# Altium project TDA2030 2.1.PrjPcb
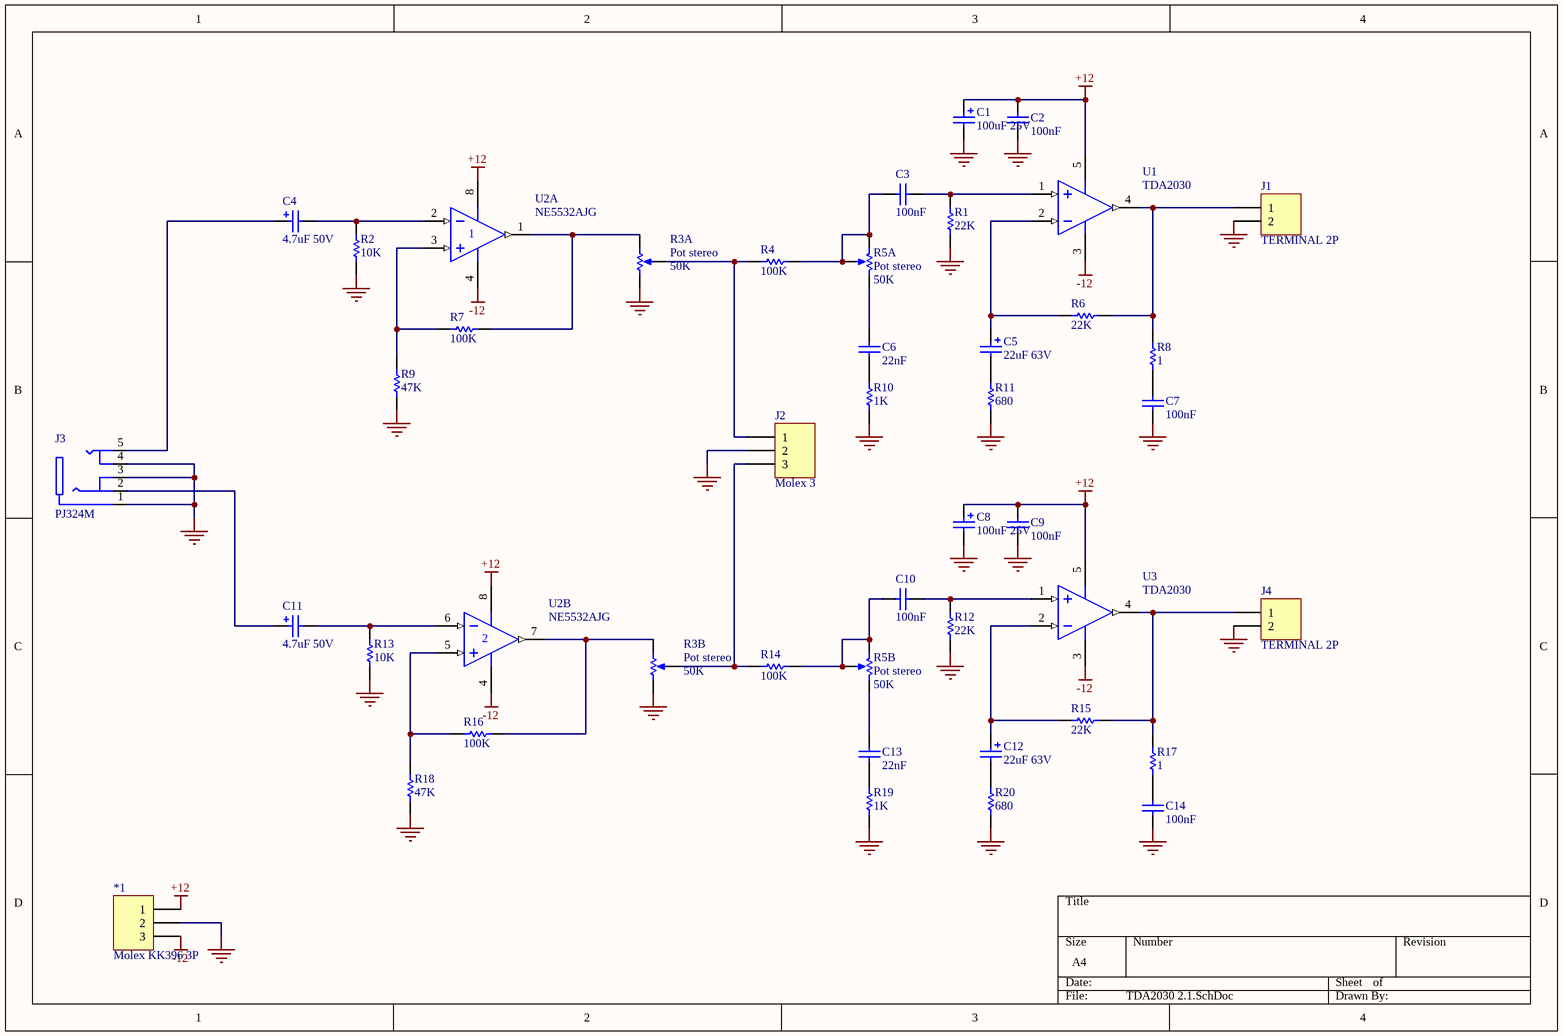
[diagram p0: TDA2030 2.1.SchDoc]
1 sheet, 42 parts. Net scope: global (net labels, ports and power ports of the same name join across sheets).
Board file: PCB.PcbDoc

## Sheet TDA2030 2.1.SchDoc
size A4

### Parts
*1  Molex KK396 3P  [Molex kk396 3P]
C1  100uF 25V  [100uF 25V]
C2  100nF  [104]
C3  100nF  [104]
C4  4.7uF 50V  [4.7uF 50V]
C5  22uF 63V  [22uF 63V]
C6  22nF  [104]
C7  100nF  [104]
C8  100uF 25V  [100uF 25V]
C9  100nF  [104]
C10  100nF  [104]
C11  4.7uF 50V  [4.7uF 50V]
C12  22uF 63V  [22uF 63V]
C13  22nF  [104]
C14  100nF  [104]
J1  TERMINAL 2P  [TERMINAL 2P]
J2  Molex 3  [Molex kk100 3P]
J3  PJ324M  [WENZHOU_PJ324M]
J4  TERMINAL 2P  [TERMINAL 2P]
R1  22K  [AXIAL-0.4]
R2  10K  [AXIAL-0.4]
R3  Pot stereo  value 50K  [Pote doble]  (parts A,B of 2)
R4  100K  [AXIAL-0.4]
R5  Pot stereo  value 50K  [Pote doble]  (parts A,B of 2)
R6  22K  [AXIAL-0.4]
R7  100K  [AXIAL-0.4]
R8  1  [AXIAL-0.4]
R9  47K  [AXIAL-0.4]
R10  1K  [AXIAL-0.4]
R11  680  [AXIAL-0.4]
R12  22K  [AXIAL-0.4]
R13  10K  [AXIAL-0.4]
R14  100K  [AXIAL-0.4]
R15  22K  [AXIAL-0.4]
R16  100K  [AXIAL-0.4]
R17  1  [AXIAL-0.4]
R18  47K  [AXIAL-0.4]
R19  1K  [AXIAL-0.4 MIA]
R20  680  [AXIAL-0.4]
U1  TDA2030  [TDA2030]
U2  NE5532AJG  [DIP-8]  (parts A,B of 2)
U3  TDA2030  [TDA2030]

### Nets
+12: *1.1 C1.1 C2.2 C8.1 C9.1 U1.5(V+) U2.8(V+) U3.5(V+)
-12: *1.3 U1.3(V-) U2.4(V-) U3.3(V-)
GND: *1.2 C1.2 C2.1 C7.2 C8.2 C9.2 C14.2 J1.2 J2.2 J3.1(SLEEVE) J3.3(RING_2) J3.4(TIP_1) J4.2 R1.1 R2.2 R3.1(TOP) R3.4(TOP) R9.2 R10.2 R11.1 R12.1 R13.2 R18.2 R19.2 R20.1
NetC3_1: C3.1 R1.2 U1.1(IN+)
NetC3_2: C3.2 R4.1 R5.2(TAP) R5.3(BOT)
NetC4_1: C4.1 J3.5(TIP_2)
NetC4_2: C4.2 R2.1 U2.2(IN-)
NetC5_1: C5.1 R6.2 U1.2(IN-)
NetC5_2: C5.2 R11.2
NetC6_1: C6.1 R10.1
NetC6_2: C6.2 R5.1(TOP)
NetC7_1: C7.1 R8.2
NetC10_1: C10.1 R12.2 U3.1(IN+)
NetC10_2: C10.2 R5.5(TAP) R5.6(BOT) R14.1
NetC11_1: C11.1 J3.2(RING_1)
NetC11_2: C11.2 R13.1 U2.6(IN-)
NetC12_1: C12.1 R15.2 U3.2(IN-)
NetC12_2: C12.2 R20.2
NetC13_1: C13.1 R19.1
NetC13_2: C13.2 R5.4(TOP)
NetC14_1: C14.1 R17.2
NetJ1_1: J1.1 R6.1 R8.1 U1.4(OUT)
NetJ2_1: J2.1 R3.2(TAP) R4.2
NetJ2_3: J2.3 R3.5(TAP) R14.2
NetJ4_1: J4.1 R15.1 R17.1 U3.4(OUT)
NetR3_3: R3.3(BOT) R7.1 U2.1(OUT)
NetR3_6: R3.6(BOT) R16.1 U2.7(OUT)
NetR7_2: R7.2 R9.1 U2.3(IN+)
NetR16_2: R16.2 R18.1 U2.5(IN+)

### Library data of the parts
C1 C8 = 100uF 25V: Polarized Capacitor (Radial); Value: 100pF; Published: 8-Jun-2000; LatestRevisionDate: 17-Jul-2002; LatestRevisionNote: Re-released for DXP Platform.; PackageReference: RB7.6-15; Publisher: Altium Limited; PackageDescription: Polarized Capacitor (Radial); 2 Leads
C2 C3 C7 C9 C10 C14 = 104: Capacitor; Value: 100pF; Published: 8-Jun-2000; LatestRevisionDate: 17-Jul-2002; LatestRevisionNote: Re-released for DXP Platform.; PackageReference: RAD-0.3; Publisher: Altium Limited; PackageDescription: Radial Cap, Thru-Hole; 2 Leads; 0.3 in Pin Spacing
C4 C11 = 4.7uF 50V: Polarized Capacitor (Radial); Value: 100pF; Published: 8-Jun-2000; LatestRevisionDate: 17-Jul-2002; LatestRevisionNote: Re-released for DXP Platform.; PackageReference: RB7.6-15; Publisher: Altium Limited; PackageDescription: Polarized Capacitor (Radial); 2 Leads
C5 C12 = 22uF 63V: Polarized Capacitor (Radial); Value: 100pF; Published: 8-Jun-2000; LatestRevisionDate: 17-Jul-2002; LatestRevisionNote: Re-released for DXP Platform.; PackageReference: RB7.6-15; Publisher: Altium Limited; PackageDescription: Polarized Capacitor (Radial); 2 Leads
C6 C13 = 223: Capacitor; Value: 100pF; Published: 8-Jun-2000; LatestRevisionDate: 17-Jul-2002; LatestRevisionNote: Re-released for DXP Platform.; PackageReference: RAD-0.3; Publisher: Altium Limited; PackageDescription: Radial Cap, Thru-Hole; 2 Leads; 0.3 in Pin Spacing
J1 J4 = TERMINAL 2P: Header, 2-Pin; LatestRevisionDate: 17-Jul-2002; LatestRevisionNote: Re-released for DXP Platform.; Publisher: Altium Limited
J2 = Molex kk100 3P: Header, 3-Pin; LatestRevisionDate: 17-Jul-2002; LatestRevisionNote: Re-released for DXP Platform.; Publisher: Altium Limited
J3 = PJ324M: Headphone Stereo jack/Audio connector; MF: Wenzhou QingPu Electronics Co.Ltd; SnapEDA_Link: https://www.snapeda.com/parts/PJ324M/Wenzhou+QingPu+Electronics+Co.Ltd/view-part/?ref=snap; Package: Package; Value: *; MP: PJ324M; Check_prices: https://www.snapeda.com/parts/PJ324M/Wenzhou+QingPu+Electronics+Co.Ltd/view-part/?ref=eda
R1 R2 R4 R6-R9 R11-R18 R20 = Res1: Resistor; Value: 1K; Published: 8-Jun-2000; LatestRevisionDate: 17-Jul-2002; LatestRevisionNote: Re-released for DXP Platform.; PackageReference: AXIAL-0.3; Publisher: Altium Limited; PackageDescription: Axial Device, Thru-Hole; 2 Leads; 0.3 in Pin Spacing
R3 R5 = RPot: Potentiometer; Sim Note: Enter the Resistance value and the set point into parameter fields.; Set Position: 0.5; Published: 8-Jun-2000; LatestRevisionDate: 17-Jul-2002; LatestRevisionNote: Re-released for DXP Platform.; PackageReference: VR5; Publisher: Altium Limited; PackageDescription: Variable Resistor, Thru-Hole; 3 Leads
R10 R19 = Res1: Resistor; Published: 8-Jun-2000; LatestRevisionDate: 17-Jul-2002; LatestRevisionNote: Re-released for DXP Platform.; PackageReference: AXIAL-0.3; Publisher: Altium Limited; PackageDescription: Axial Device, Thru-Hole; 2 Leads; 0.3 in Pin Spacing; Value: 1K
U2 = NE5532AJG: Dual Low-Noise Operational Amplifier; Published: 15-Apr-2002; LatestRevisionDate: 04-Mar-2005; LatestRevisionNote: Stylized 3D Model Added.; DatasheetVersion: May-1988; PackageVersion: Jan-1995; PackageReference: JG008; Publisher: Altium Limited; PackageDescription: DIP; 8 Leads; Row Spacing 7.62 mm; Pitch 2.54 mm; ComponentLink1Description: Manufacturer Link; ComponentLink1URL: http://www.ti.com/; ComponentLink2Description: Datasheet; ComponentLink2URL: http://www-s.ti.com/sc/ds/ne5532a.pdf